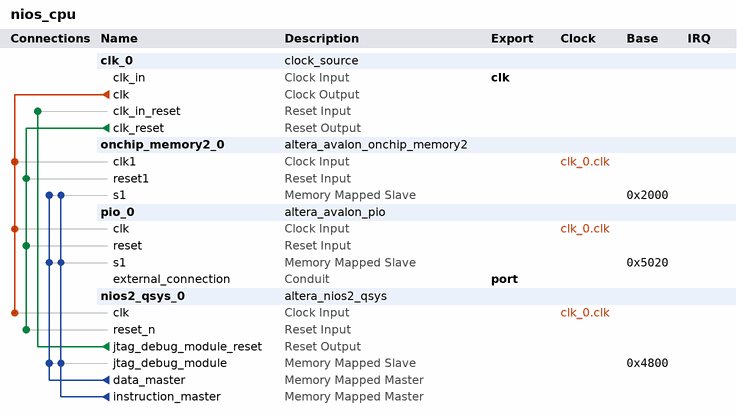
[diagram p0: system contents]
# Platform Designer (Qsys) system nios_cpu, Cyclone IV E EP4CE10E22I7
# Parameters at their usual value, and those the tool derives, are not listed.
package require -exact qsys 15.1
create_system nios_cpu
set_project_property DEVICE_FAMILY {Cyclone IV E}
set_project_property DEVICE EP4CE10E22I7

add_instance clk_0 clock_source 15.1
set_instance_parameter_value clk_0 clockFrequency 50000000

add_instance onchip_memory2_0 altera_avalon_onchip_memory2 15.1
set_instance_parameter_value onchip_memory2_0 dataWidth 32
set_instance_parameter_value onchip_memory2_0 dualPort false
set_instance_parameter_value onchip_memory2_0 initMemContent true
set_instance_parameter_value onchip_memory2_0 initializationFileName E:/projects/prj_fpga_altera/prj_VE-EP4CE10E/EP4CE10E/sourse/nios_II/software/nios_first/mem_init/onchip_mem.hex
set_instance_parameter_value onchip_memory2_0 memorySize 8192

add_instance pio_0 altera_avalon_pio 15.1
set_instance_parameter_value pio_0 bitModifyingOutReg true
set_instance_parameter_value pio_0 direction Output
set_instance_parameter_value pio_0 width 32

add_instance nios2_qsys_0 altera_nios2_qsys 15.1
set_instance_parameter_value nios2_qsys_0 breakSlave nios2_qsys_0.jtag_debug_module
set_instance_parameter_value nios2_qsys_0 exceptionSlave onchip_memory2_0.s1
set_instance_parameter_value nios2_qsys_0 icache_size 4096
set_instance_parameter_value nios2_qsys_0 impl Tiny
set_instance_parameter_value nios2_qsys_0 mmu_TLBMissExcSlave None
set_instance_parameter_value nios2_qsys_0 resetSlave onchip_memory2_0.s1
set_instance_parameter_value nios2_qsys_0 resetrequest_enabled true

# connections
add_connection clk_0.clk nios2_qsys_0.clk clock
add_connection clk_0.clk onchip_memory2_0.clk1 clock
add_connection clk_0.clk pio_0.clk clock
add_connection clk_0.clk_reset nios2_qsys_0.reset_n reset
add_connection clk_0.clk_reset onchip_memory2_0.reset1 reset
add_connection clk_0.clk_reset pio_0.reset reset
add_connection nios2_qsys_0.jtag_debug_module_reset clk_0.clk_in_reset reset
add_connection nios2_qsys_0.data_master nios2_qsys_0.jtag_debug_module avalon
set_connection_parameter_value nios2_qsys_0.data_master/nios2_qsys_0.jtag_debug_module baseAddress 0x4800
add_connection nios2_qsys_0.data_master onchip_memory2_0.s1 avalon
set_connection_parameter_value nios2_qsys_0.data_master/onchip_memory2_0.s1 baseAddress 0x2000
add_connection nios2_qsys_0.data_master pio_0.s1 avalon
set_connection_parameter_value nios2_qsys_0.data_master/pio_0.s1 baseAddress 0x5020
add_connection nios2_qsys_0.instruction_master nios2_qsys_0.jtag_debug_module avalon
set_connection_parameter_value nios2_qsys_0.instruction_master/nios2_qsys_0.jtag_debug_module baseAddress 0x4800
add_connection nios2_qsys_0.instruction_master onchip_memory2_0.s1 avalon
set_connection_parameter_value nios2_qsys_0.instruction_master/onchip_memory2_0.s1 baseAddress 0x2000
add_connection nios2_qsys_0.instruction_master pio_0.s1 avalon
set_connection_parameter_value nios2_qsys_0.instruction_master/pio_0.s1 baseAddress 0x5020

# exported interfaces
add_interface clk clock sink
set_interface_property clk EXPORT_OF clk_0.clk_in
add_interface port conduit end
set_interface_property port EXPORT_OF pio_0.external_connection

set_interconnect_requirement {$system} qsys_mm.clockCrossingAdapter HANDSHAKE
set_interconnect_requirement {$system} qsys_mm.enableEccProtection FALSE
set_interconnect_requirement {$system} qsys_mm.insertDefaultSlave FALSE
set_interconnect_requirement {$system} qsys_mm.maxAdditionalLatency 1

save_system nios_cpu.qsys
